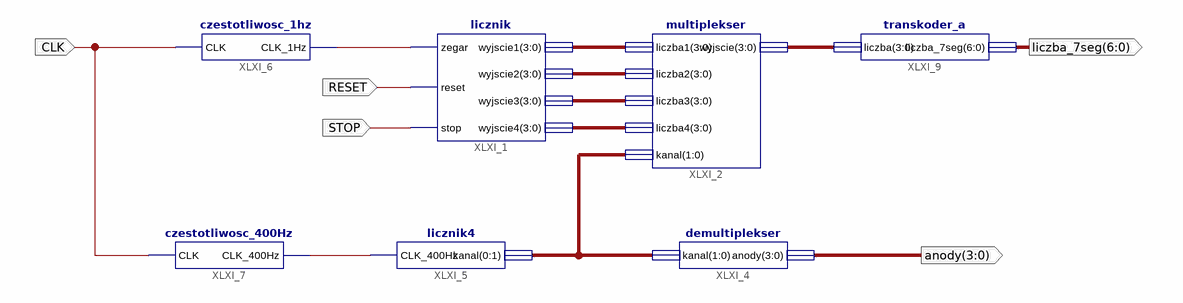
[diagram p0: schematic sheet 1]
// Xilinx ISE schematic schemat.sch (xbr) as structural Verilog: 7 symbols, 5 ports
module schemat (
  input  CLK,
  input  RESET,
  input  STOP,
  output [6:0] liczba_7seg,
  output [3:0] anody
);

  wire XLXN_1, XLXN_2;
  wire [1:0] XLXN_9;
  wire [3:0] XLXN_3, XLXN_4, XLXN_6, XLXN_7, XLXN_10;

  licznik XLXI_1 (
    .zegar(XLXN_2), .reset(RESET), .stop(STOP), .wyjscie1(XLXN_3), .wyjscie2(XLXN_4), .wyjscie3(XLXN_7),
    .wyjscie4(XLXN_6));
  multiplekser XLXI_2 (
    .liczba1(XLXN_3), .liczba2(XLXN_4), .liczba3(XLXN_7), .liczba4(XLXN_6), .kanal(XLXN_9), .wyjscie(XLXN_10));
  demultiplekser XLXI_4 (.kanal(XLXN_9), .anody(anody));
  licznik4 XLXI_5 (.CLK_400Hz(XLXN_1), .kanal(XLXN_9));
  czestotliwosc_1hz XLXI_6 (.CLK(CLK), .CLK_1Hz(XLXN_2));
  czestotliwosc_400Hz XLXI_7 (.CLK(CLK), .CLK_400Hz(XLXN_1));
  transkoder_a XLXI_9 (.liczba(XLXN_10), .liczba_7seg(liczba_7seg));
endmodule
